# EAGLE design Group_05 (EAGLE 9.6.2)
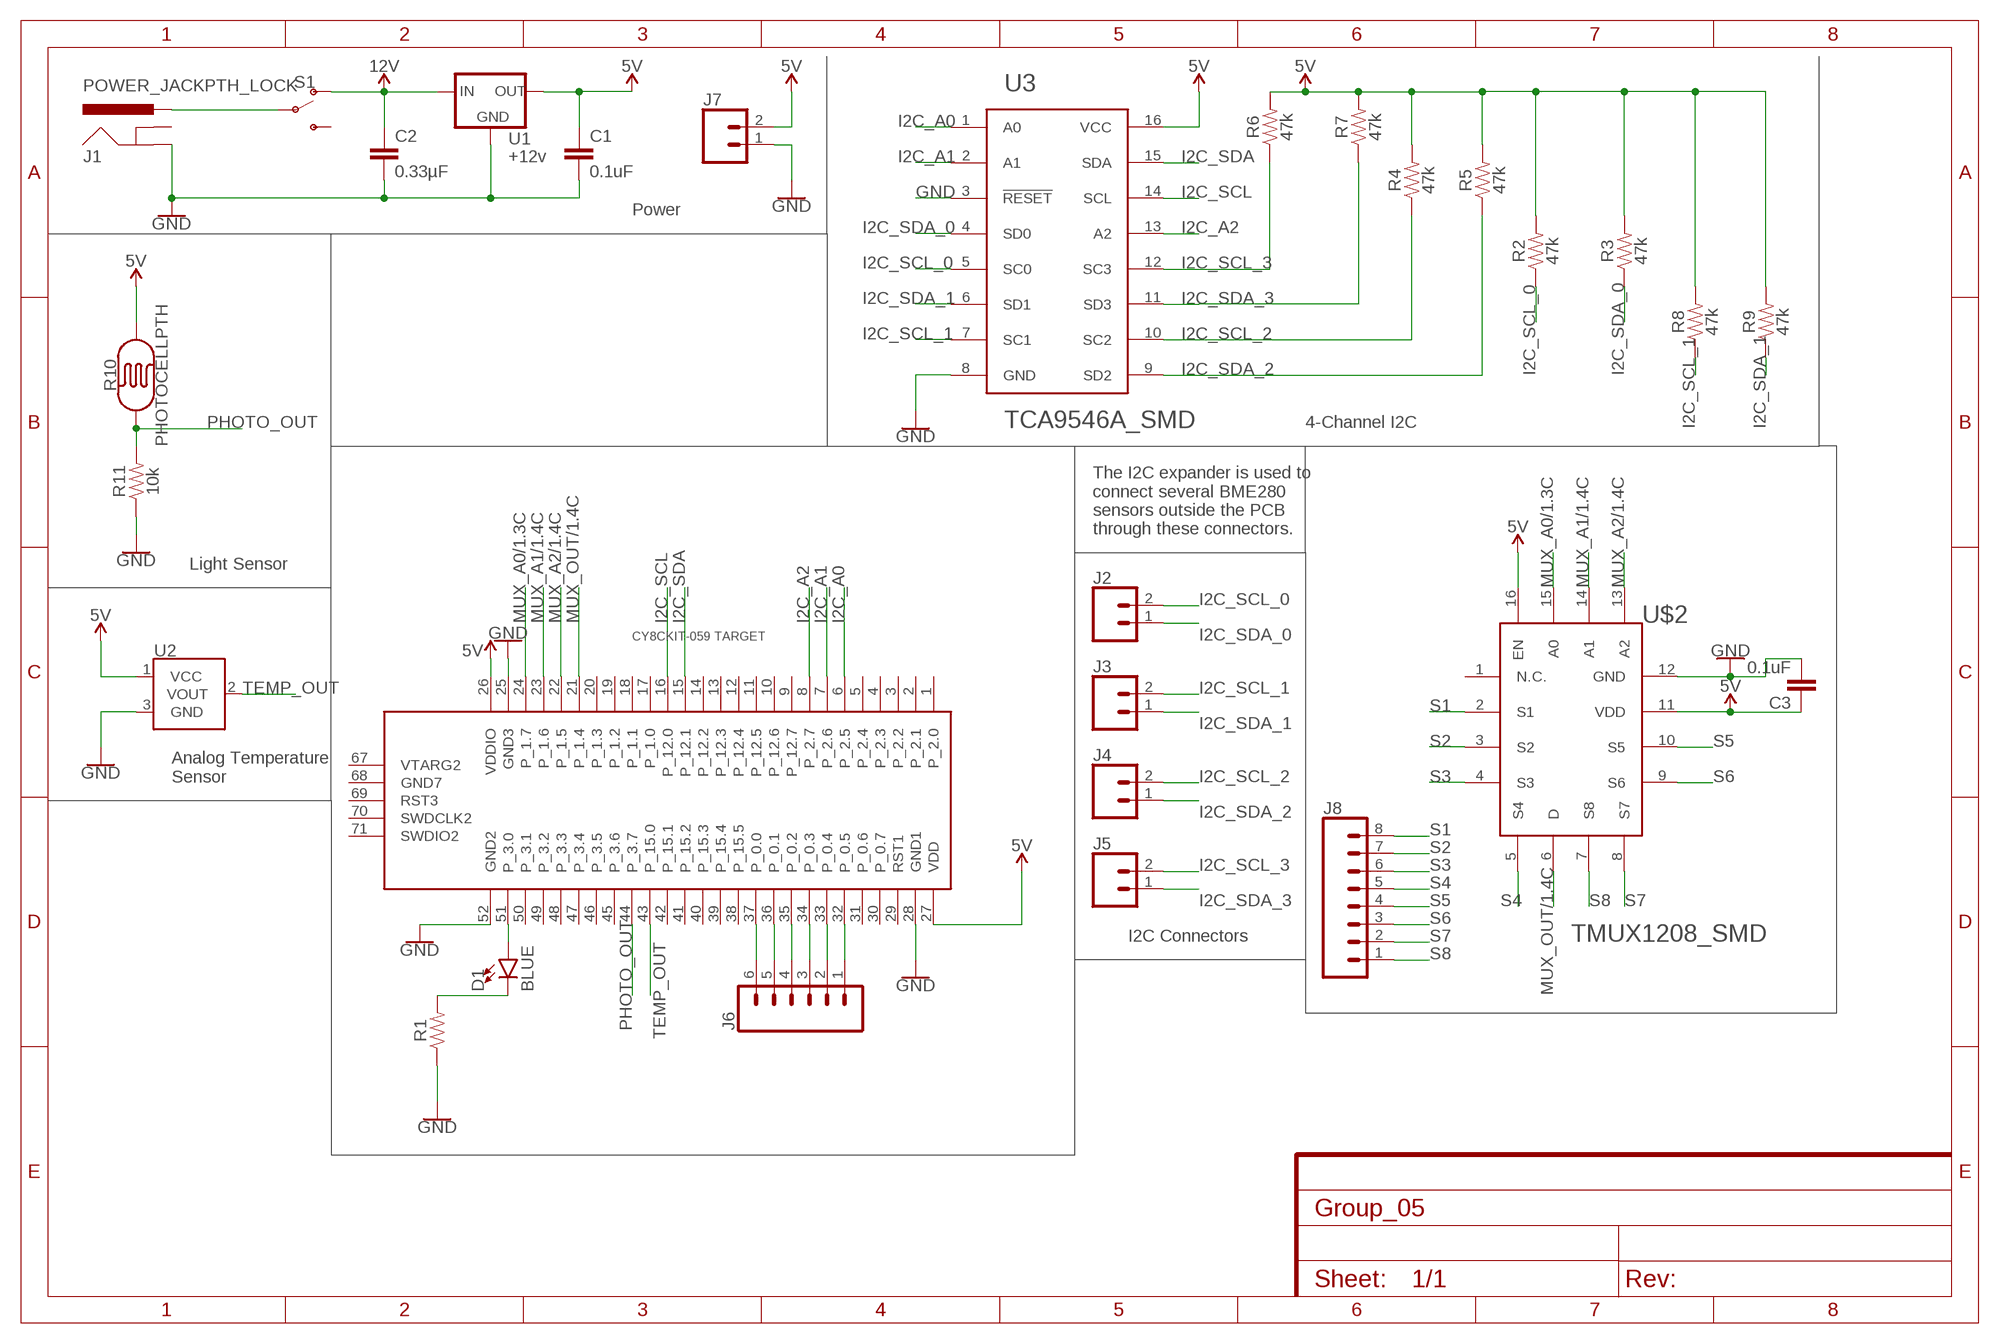
[diagram p0: schematic, sheet 1]

## Parts
C1  0.1uF  0.1UF-KIT-EZ-50V-20%  [CAP-PTH-SMALL-KIT]
C2  0.33µF  0.33UF/330NF-0805-50V-10%  [0805]
C3  0.1uF  0.1UF-KIT-EZ-50V-20%  [CAP-PTH-SMALL-KIT]
D1  BLUE  LED-BLUE1206  [LED-1206]
J1  POWER_JACKPTH_LOCK  [POWER_JACK_PTH_LOCK]
J2  CONN_02  [1X02]
J3  CONN_02  [1X02]
J4  CONN_02  [1X02]
J5  CONN_02  [1X02]
J6  CONN_06LOCK  [1X06_LOCK]
J7  CONN_02  [1X02]
J8  CONN_08LOCK  [1X08_LOCK]
R1  RESISTORAXIAL-0.3  [AXIAL-0.3]
R2  47k  47KOHM-0603-1/10W-1%  [0603]
R3  47k  47KOHM-0603-1/10W-1%  [0603]
R4  47k  47KOHM-0603-1/10W-1%  [0603]
R5  47k  47KOHM-0603-1/10W-1%  [0603]
R6  47k  47KOHM-0603-1/10W-1%  [0603]
R7  47k  47KOHM-0603-1/10W-1%  [0603]
R8  47k  47KOHM-0603-1/10W-1%  [0603]
R9  47k  47KOHM-0603-1/10W-1%  [0603]
R10  PHOTOCELLPTH  [PHOTOCELL]
R11  10k  10KOHM-0603-1/10W-1%  [0603]
S1  SWITCH-SPDT-PTH-11.6X4.0MM  [SWITCH_SPDT_PTH_11.6X4.0MM]
U1  +12v  V_REG_78XX7812  [TO-252]
U2  TMP36GT9  [TO-92]
U3  TCA9546A_SMD  [TSSOP16]
U$1  CY8CKIT-059_TARGET  [CY8CKIT-059_TARGET]
U$2  TMUX1208_SMD  [QFN16]

## Nets
5V: C1.1 C3.1 J7.2 R2.2 R3.2 R4.2 R5.2 R6.2 R7.2 R8.2 R9.2 R10.2 U1.2(OUT) U2.1(VCC) U3.16(VCC) U$1.26(VDDIO) U$1.27(VDD) U$2.11(VDD) U$2.16(EN)
12V: C2.1 S1.1(O) U1.1(IN)
GND: C1.2 C2.2 C3.2 J1.GND J7.1 R1.P$1 R11.1 U1.3(GND) U2.3(GND) U3.3(!RESET) U3.8(GND) U$1.25(GND3) U$1.28(GND1) U$1.52(GND2) U$2.12(GND)
I2C_A0: U3.1(A0) U$1.6(P_2.5)
I2C_A1: U3.2(A1) U$1.7(P_2.6)
I2C_A2: U3.13(A2) U$1.8(P_2.7)
I2C_SCL: U3.14(SCL) U$1.16(P_12.0)
I2C_SCL_0: J2.2 R2.1 U3.5(SC0)
I2C_SCL_1: J3.2 R8.1 U3.7(SC1)
I2C_SCL_2: J4.2 R4.1 U3.10(SC2)
I2C_SCL_3: J5.2 R6.1 U3.12(SC3)
I2C_SDA: U3.15(SDA) U$1.15(P_12.1)
I2C_SDA_0: J2.1 R3.1 U3.4(SD0)
I2C_SDA_1: J3.1 R9.1 U3.6(SD1)
I2C_SDA_2: J4.1 R5.1 U3.9(SD2)
I2C_SDA_3: J5.1 R7.1 U3.11(SD3)
MUX_A0/1.3C: U$1.24(P_1.7) U$2.15(A0)
MUX_A1/1.4C: U$1.23(P_1.6) U$2.14(A1)
MUX_A2/1.4C: U$1.22(P_1.5) U$2.13(A2)
MUX_OUT/1.4C: U$1.21(P_1.4) U$2.6(D)
N$1: J6.6 U$1.37(P_0.0)
N$2: D1.A U$1.51(P_3.0)
N$3: J1.PWR S1.2(P)
N$4: D1.C R1.P$2
N$5: J6.5 U$1.36(P_0.1)
N$6: J6.4 U$1.35(P_0.2)
N$7: J6.3 U$1.34(P_0.3)
N$8: J6.2 U$1.33(P_0.4)
N$9: J6.1 U$1.32(P_0.5)
PHOTO_OUT: R10.1 R11.2 U$1.44(P_3.7)
S1: J8.8 U$2.2(S1)
S2: J8.7 U$2.3(S2)
S3: J8.6 U$2.4(S3)
S4: J8.5 U$2.5(S4)
S5: J8.4 U$2.10(S5)
S6: J8.3 U$2.9(S6)
S7: J8.2 U$2.8(S7)
S8: J8.1 U$2.7(S8)
TEMP_OUT: U2.2(VOUT) U$1.43(P_15.0)
Unconnected: J1.GNDBREAK S1.3(S) U$1.1(P_2.0) U$1.2(P_2.1) U$1.3(P_2.2) U$1.4(P_2.3) U$1.5(P_2.4) U$1.9(P_12.7) U$1.10(P_12.6) U$1.11(P_12.5) U$1.12(P_12.4) U$1.13(P_12.3) U$1.14(P_12.2) U$1.17(P_1.0) U$1.18(P_1.1) U$1.19(P_1.2) U$1.20(P_1.3) U$1.29(RST1) U$1.30(P_0.7) U$1.31(P_0.6) U$1.38(P_15.5) U$1.39(P_15.4) U$1.40(P_15.3) U$1.41(P_15.2) U$1.42(P_15.1) U$1.45(P_3.6) U$1.46(P_3.5) U$1.47(P_3.4) U$1.48(P_3.3) U$1.49(P_3.2) U$1.50(P_3.1) U$1.67(VTARG2) U$1.68(GND7) U$1.69(RST3) U$1.70(SWDCLK2) U$1.71(SWDIO2) U$2.1(N.C.)

## Notes on the sheet
- Power
- 4-Channel I2C
- The I2C expander is used to 
  connect several BME280 
  sensors outside the PCB 
  through these connectors.
- Light Sensor
- Analog Temperature
  Sensor
- I2C Connectors

## Library data of the parts
C1 C3 = SparkFun-Capacitors:0.1UF: 0.1µF ceramic capacitors A capacitor is a passive two-terminal electrical component used to store electrical energy temporarily in an electric field.; PROD_ID: CAP-08370
C2 = SparkFun-Capacitors:0.33UF/330NF: 0.33µF/330nF ceramic capacitors A capacitor is a passive two-terminal electrical component used to store electrical energy temporarily in an electric field.; PROD_ID: CAP-08469
D1 = SparkFun-LED:LED-BLUE: Blue SMD LED Used in manufacturing of various products at SparkFun Packages: 0603 - SMD 0603 package [Product Link] <http://www.digikey.com/product-detail/en/SMLE12BC7TT86/511-1589-2-ND/1641808> 1206 - SMD1206 package [Product Link] <http://www.digikey.com/product-detail/en/lite-on-inc/LTST-C150TBKT/160-1643-1-ND/573584> SparkFun Products: ESP8266 Thing-Dev Board <https://www.sparkfun.com/products/13711> RedBoard <https://www.sparkfun.com/products/12757>; PROD_ID: DIO-09911
J1 = SparkFun-Connectors:POWER_JACK: Power Jack Connector This is the standard 5.5mm barrel jack for power. The PTH is the most common, proven, reliable, footprint. The Slot footprint only works if the mill layer is transmitted to the PCB fab house so be warned. Here are the connectors we sell at SparkFun: DC Barrel Power Jack/Connector <https://www.sparkfun.com/products/119> (PRT-00119) DC Barrel Power Jack/Connector (SMD) <https://www.sparkfun.com/products/12748> (PRT-12748) DC Barrel Jack Adapter - Breadboard Compatible <https://www.sparkfun.com/products/10811> (PRT-10811) It is used on this SparkFun product (and many, many others): SparkFun RedBoard - Programmed with Arduino <https://www.sparkfun.com/products/12757> (DEV-12757) Also, if you need a mating power supply or connector, please check these out: Wall Adapter Power Supply - 9VDC 650mA <https://www.sparkfun.com/products/298> (TOL-00298) DC Barrel Jack Adapter - Male <https://www.sparkfun.com/products/10287> (PRT-10287); PROD_ID: CONN-08197; SF_ID: PRT-00119
J2-J5 J7 = SparkFun-Connectors:CONN_02: Multi connection point. Often used as Generic Header-pin footprint for 0.1 inch spaced/style header connections On any of the 0.1 inch spaced packages, you can populate with these: Break Away Headers - Straight <https://www.sparkfun.com/products/116> (PRT-00116) Break Away Male Headers - Right Angle <https://www.sparkfun.com/products/553> (PRT-00553) Female Headers <https://www.sparkfun.com/products/115> (PRT-00115) Break Away Headers - Machine Pin <https://www.sparkfun.com/products/117> (PRT-00117) Break Away Female Headers - Swiss Machine Pin <https://www.sparkfun.com/products/743> (PRT-00743) For SCREWTERMINALS and SPRING TERMINALS visit here: Screw Terimnals on SparkFun.com <https://www.sparkfun.com/search/results?term=Screw+Terminals> (5mm/3.5mm/2.54mm spacing) This device is also useful as a general connection point to wire up your design to another part of your project. Our various solder wires solder well into these plated through hole pads. Hook-Up Wire - Assortment (Stranded, 22 AWG) <https://www.sparkfun.com/products/11375> (PRT-11375) Hook-Up Wire - Assortment (Solid Core, 22 AWG) <https://www.sparkfun.com/products/11367> (PRT-11367) View the entire wire category on our website here <https://www.sparkfun.com/categories/141> Special notes: Molex polarized connector foot print use with: PRT-08233 with associated crimp pins and housings. 2.54_SCREWTERM for use with PRT-10571. 3.5mm Screw Terminal footprints for PRT-08084 5mm Screw Terminal footprints for use with PRT-08432
J6 = SparkFun-Connectors:CONN_06: Multi connection point. Often used as Generic Header-pin footprint for 0.1 inch spaced/style header connections On any of the 0.1 inch spaced packages, you can populate with these: Break Away Headers - Straight <https://www.sparkfun.com/products/116> (PRT-00116) Break Away Male Headers - Right Angle <https://www.sparkfun.com/products/553> (PRT-00553) Female Headers <https://www.sparkfun.com/products/115> (PRT-00115) Break Away Headers - Machine Pin <https://www.sparkfun.com/products/117> (PRT-00117) Break Away Female Headers - Swiss Machine Pin <https://www.sparkfun.com/products/743> (PRT-00743) Arduino Stackable Header - 6 Pin <https://www.sparkfun.com/products/9280> (PRT-09280) For SCREWTERMINALS and SPRING TERMINALS visit here: Screw Terimnals on SparkFun.com <https://www.sparkfun.com/search/results?term=Screw+Terminals> (5mm/3.5mm/2.54mm spacing) This device is also useful as a general connection point to wire up your design to another part of your project. Our various solder wires solder well into these plated through hole pads. Hook-Up Wire - Assortment (Stranded, 22 AWG) <https://www.sparkfun.com/products/11375> (PRT-11375) Hook-Up Wire - Assortment (Solid Core, 22 AWG) <https://www.sparkfun.com/products/11367> (PRT-11367) View the entire wire category on our website here <https://www.sparkfun.com/categories/141>
J8 = SparkFun-Connectors:CONN_08: Multi connection point. Often used as Generic Header-pin footprint for 0.1 inch spaced/style header connections On any of the 0.1 inch spaced packages, you can populate with these: Break Away Headers - Straight <https://www.sparkfun.com/products/116> (PRT-00116) Break Away Male Headers - Right Angle <https://www.sparkfun.com/products/553> (PRT-00553) Female Headers <https://www.sparkfun.com/products/115> (PRT-00115) Break Away Headers - Machine Pin <https://www.sparkfun.com/products/117> (PRT-00117) Break Away Female Headers - Swiss Machine Pin <https://www.sparkfun.com/products/743> (PRT-00743) Arduino Stackable Header - 8 Pin <https://www.sparkfun.com/products/9279> (PRT-09279) For SCREWTERMINALS and SPRING TERMINALS visit here: Screw Terimnals on SparkFun.com <https://www.sparkfun.com/search/results?term=Screw+Terminals> (5mm/3.5mm/2.54mm spacing) This device is also useful as a general connection point to wire up your design to another part of your project. Our various solder wires solder well into these plated through hole pads. Hook-Up Wire - Assortment (Stranded, 22 AWG) <https://www.sparkfun.com/products/11375> (PRT-11375) Hook-Up Wire - Assortment (Solid Core, 22 AWG) <https://www.sparkfun.com/products/11367> (PRT-11367) View the entire wire category on our website here <https://www.sparkfun.com/categories/141> Special notes: Molex polarized connector foot print use with SKU : PRT-08231 with associated crimp pins and housings. 1MM SMD Version SKU: PRT-10208 NOTES ON THE VARIANTS LOCK and LOCK_LONGPADS... This footprint was designed to help hold the alignment of a through-hole component (i.e. 6-pin header) while soldering it into place. You may notice that each hole has been shifted either up or down by 0.005 of an inch from it's more standard position (which is a perfectly straight line). This slight alteration caused the pins (the squares in the middle) to touch the edges of the holes. Because they are alternating, it causes a "brace" to hold the component in place. 0.005 has proven to be the perfect amount of "off-center" position when using our standard breakaway headers. Although looks a little odd when you look at the bare footprint, once you have a header in there, the alteration is very hard to notice. Also,if you push a header all the way into place, it is covered up entirely on the bottom side.
R1 = SparkFun-Resistors:RESISTOR: Generic Resistor Package
R2-R9 = SparkFun-Resistors:47KOHM: 47kΩ resistor A resistor is a passive two-terminal electrical component that implements electrical resistance as a circuit element. Resistors act to reduce current flow, and, at the same time, act to lower voltage levels within circuits. - Wikipedia; PROD_ID: RES-07871
R10 = SparkFun-Sensors:PHOTOCELL: Photocell (Photodetector, Photo Resistor, CdS) This is a very small light sensor. A photocell changes (also called a photodetector, photo resistor, CdS or photoconductive cell) resistance depending on the amount of light it is exposed to. These little sensors make great ambient light triggers (when light in the room turns on, do something). Datasheet <http://cdn.sparkfun.com/datasheets/Sensors/LightImaging/SEN-09088.pdf> SparkFun Products Mini Photocell <https://www.sparkfun.com/products/9088> (SEN-09088); PROD_ID: COMP-09129; SF_ID: SEN-09088
R11 = SparkFun-Resistors:10KOHM: 10kΩ resistor A resistor is a passive two-terminal electrical component that implements electrical resistance as a circuit element. Resistors act to reduce current flow, and, at the same time, act to lower voltage levels within circuits. - Wikipedia; PROD_ID: RES-00824
S1 = SparkFun-Switches:SWITCH-SPDT: Single Pole, Double Throw (SPDT) Switch Single-pole, double-throw (SPDT) switch. Variant Overview SMD-AYZ0202 Surface Mount DPDT Switch <https://www.sparkfun.com/products/597> (COM-00597) Used on e.g. LilyPad Arduino USB - ATmega32U4 Board <https://www.sparkfun.com/products/12049> PTH-11.6X4.0MM SPDT Mini Power Switch <https://www.sparkfun.com/products/102> (COM-00102) Used on e.g. SparkFun Simon Says - Through-Hole Soldering Kit <https://www.sparkfun.com/products/10547> (KIT-10547) PTH-11.6X4.0MM-KIT KIT version of SPDT Mini Power Switch - Simplifies soldering by removing tStop of switch pins - only one side can be soldered. PTH-11.6X4.0MM-LOCK LOCK version of SPDT Mini Power Switch - Offset pins hold switch in place for easier soldering. SMD-RIGHT-ANGLE Surface Mount Right Angle Switch <https://www.sparkfun.com/products/10860> (COM-10860) Used on e.g. SparkFun ESP8266 Thing <https://www.sparkfun.com/products/13231>; PROD_ID: SWCH-08261; SF_SKU: COM-00102
U1 = SparkFun-IC-Power:V_REG_78XX: Voltage Regulator Standard 78xx regulator. IGO (Input Ground Output). Spark Fun Electronics SKU : COM-00107; PROD_ID: VREG-12370
U2 = SparkFun-Sensors:TMP36: TMP36 Precision Analog °C Temperature Sensor The TMP36 is a low voltage, precision centigrade temperature sensor. It provides a voltage output that is linearly proportional to the Celsius temperature. It also doesn’t require any external calibration to provide typical accuracies of ±1°C at +25°C and ±2°C over the −40°C to +125°C temperature range. We like it because it’s so easy to use: Just give the device a ground and 2.7 to 5.5 VDC and read the voltage on the Vout pin. The output voltage can be converted to temperature easily using the scale factor of 10 mV/°C. Datasheet <http://cdn.sparkfun.com/datasheets/Sensors/Temp/TMP35_36_37.pdf> SparkFun Products Temperature Sensor - TMP36 <https://www.sparkfun.com/products/10988> (SEN-10988) SparkFun Danger Shield <https://www.sparkfun.com/products/11649> (DEV-11649); PROD_ID: IC-09880; SF_ID: SEN-10988
U3 = Group_05_Library:TCA9546A: TCA9546A The TCA9546A is a quad bidirectional translating switch controlled via the I2C bus. The SCL/SDA upstream pair fans out to four downstream pairs, or channels. An active-low reset input allows the TCA9546A to recover from a situation in which one of the downstream I2C buses is stuck in a low state. The pass gates of the switches are constructed such that the VCC pin can be used to limit the maximum high voltage, which will be passed by the TCA9546A. This allows the use of different bus voltages on each pair, so that 1.8-V, 2.5-V, or 3.3-V parts can communicate with 5-V parts without any additional protection. External pull-up resistors pull the bus up to the desired voltage level for each channel. All I/O pins are 5.5-V tolerant.
U$1 = CY8KIT-059:CY8CKIT-059_TARGET: CY8CKIT-059 Target This device exposes the pins of the target section of the CY8CKIT-059, including the programming section, that must be connected to the KitProg in order to program the target micro-controller.
U$2 = Group_05_Library:TMUX1208: TMUX1208 The TMUX1208 is a general purpose complementary metal-oxide semiconductor (CMOS) multiplexers (MUX). It offers 8:1 single-ended channels. Wide operating supply of 1.08 V to 5.5 V. The device supports bidirectional analog and digital signals on the source (Sx) and drain (D) pins ranging from GND to VDD. All logic inputs have 1.8 V logic compatible thresholds, ensuring both TTL and CMOS logic compatibility when operating in the valid supply voltage range.

## Board
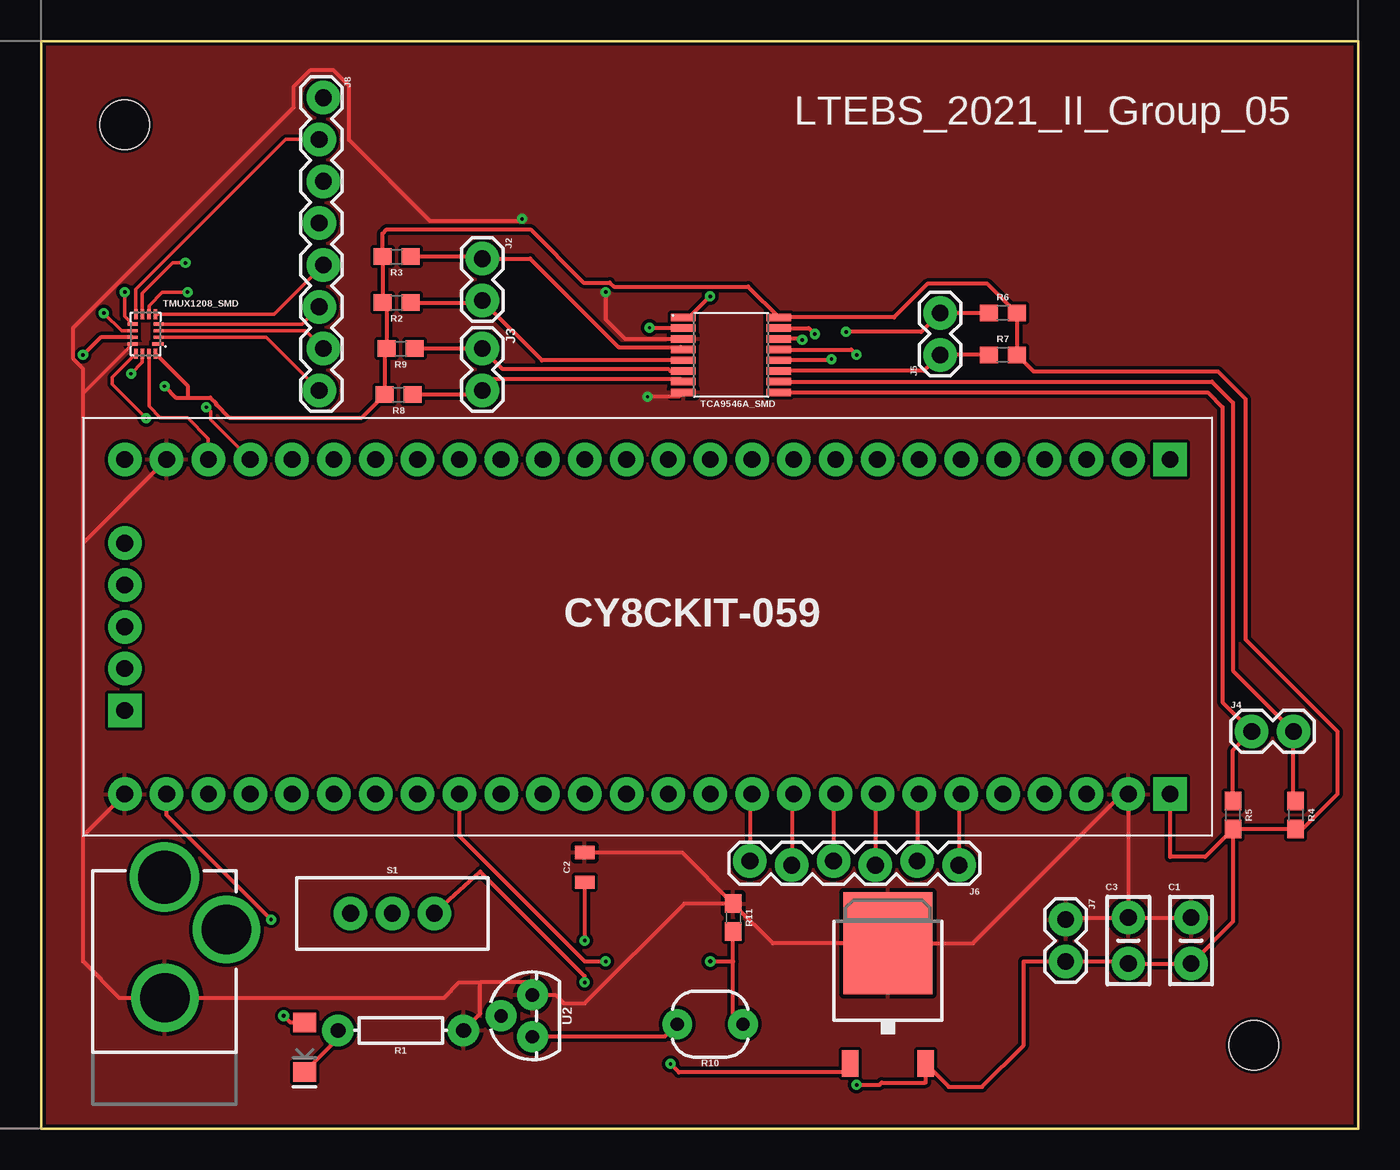
[diagram p1: board, top side]
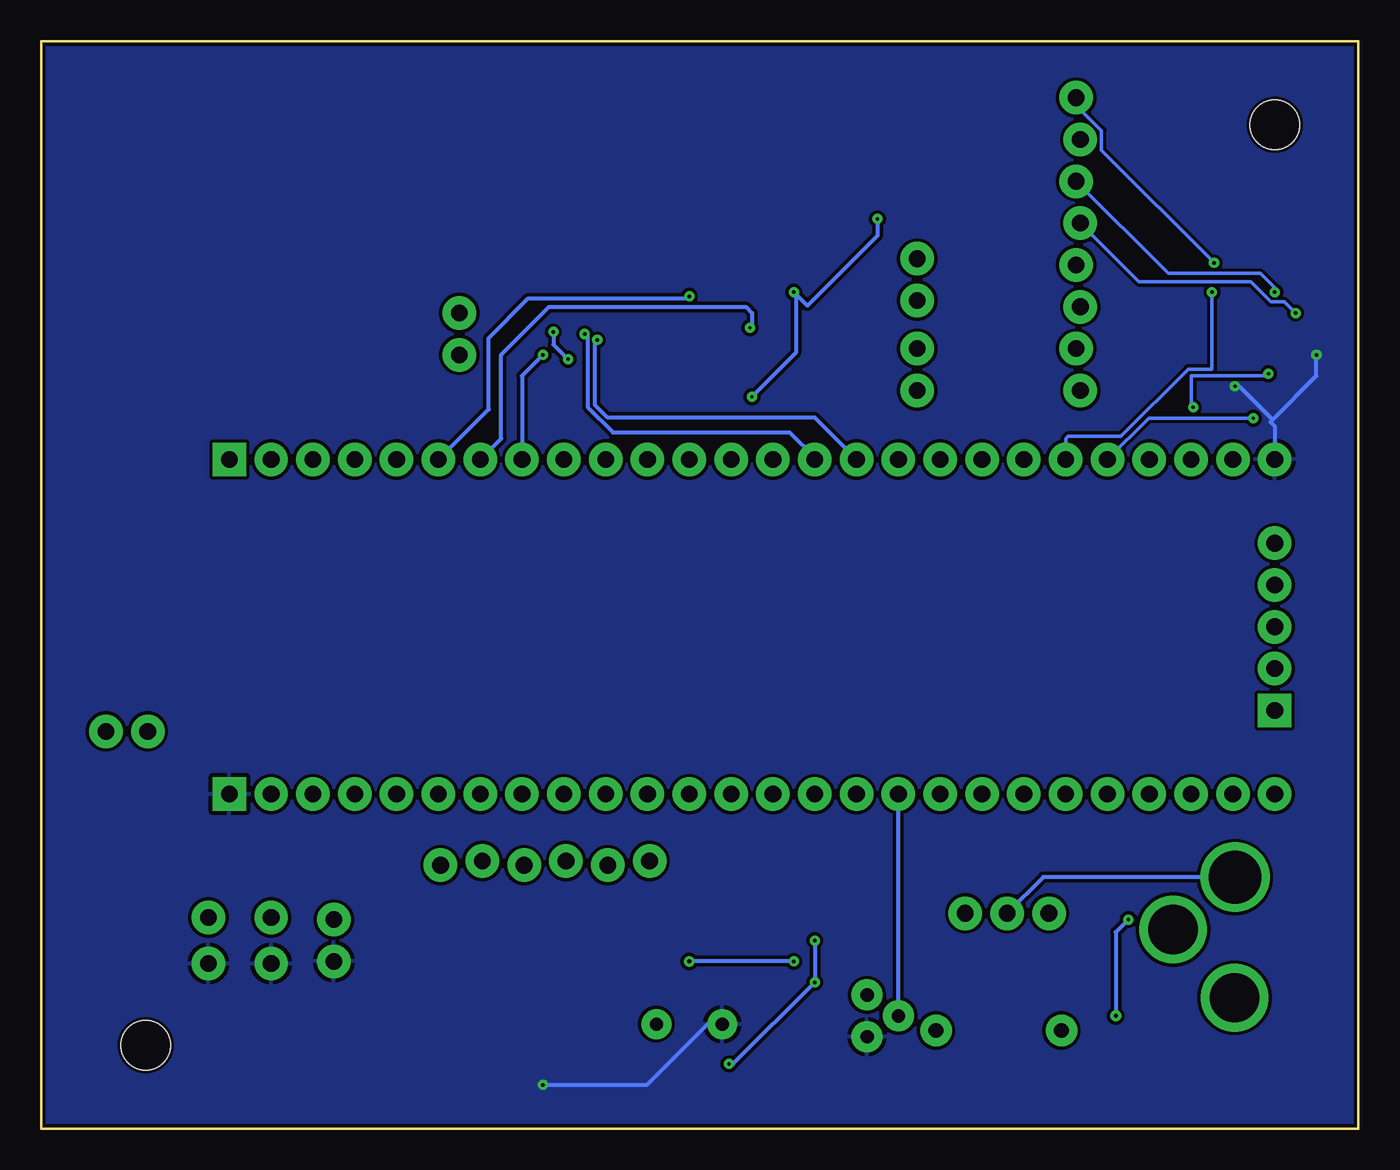
[diagram p2: board, bottom side, seen from below]

Size 80.01 x 66.04 mm. Coordinates in mm from the lower left corner, seen from the top.
Outline: 0,0 80.01,0 80.01,66.04 0,66.04 0,0
Copper layers (1*16): Top 0.035mm / dielectric 1.5mm / Bottom 0.035mm
Design rules "Group_05": minimum track width 6mil, minimum drill 8mil, track to track 6mil, track to pad 6mil, pad to pad 6mil, via to via 6mil, smd to smd 6mil, copper to edge 8mil, drill to drill 16mil, minimum pad ring 8mil, minimum via ring 8mil, stop-mask expansion 8mil, vias tented up to drill 0mil, thermal gap 10mil
Holes 3 mm at 5.08,60.96 73.66,5.08

### Footprints (pad centres in the part's own frame; a part is rotated, then mirrored left to right if it is on the bottom)
CAP-PTH-SMALL-KIT = drill 1.016 pad 2.032: 1 -1.397,0; 2 1.397,0
0805 = smd 0.8 x 1.2: 1 -0.9,0; 2 0.9,0
LED-1206 = smd 1.2 x 1.4: A -1.5,0; C 1.5,0
POWER_JACK_PTH_LOCK = drill 2.997 pad 4.115: GND 0.025,6.557; GNDBREAK 3.762,10.7 | drill 3.2 pad 4.115: PWR 0,13.878
1X02 = drill 1.016 pad 1.88: 1 0,0; 2 2.54,0
1X06_LOCK = drill 1.016 pad 1.88: 1 0,0; 2 2.54,-0.254; 3 5.08,0; 4 7.62,-0.254; 5 10.16,0; 6 12.7,-0.254
1X08_LOCK = drill 1.016 pad 1.88: 1 0,0.127; 2 2.54,-0.127; 3 5.08,0.127; 4 7.62,-0.127; 5 10.16,0.127; 6 12.7,-0.127; 7 15.24,0.127; 8 17.78,-0.127
AXIAL-0.3 = drill 0.9 pad 1.88: P$1 -3.81,0; P$2 3.81,0
0603 = smd 1.1 x 1: 1 -0.85,0; 2 0.85,0
PHOTOCELL = drill 0.8 pad 1.676: 1 -2,0; 2 2,0
SWITCH_SPDT_PTH_11.6X4.0MM = drill 1.016 pad 1.88: 1 0,2.54; 2 0,0; 3 0,-2.54
TO-252 = smd 1 x 1.6: 1 -2.28,-4.8; 2 2.28,-4.8 | smd 5.4 x 6.2: 3 0,2.5
TO-92 = drill 0.813 pad 1.88: 1 -1.27,0; 2 0,1.905; 3 1.27,0
TSSOP16 = smd 1.5 x 0.45: 1 -2.9,2.275; 2 -2.9,1.625; 3 -2.9,0.975; 4 -2.9,0.325; 5 -2.9,-0.325; 6 -2.9,-0.975; 7 -2.9,-1.625; 8 -2.9,-2.275; 9 2.9,-2.275; 10 2.9,-1.625; 11 2.9,-0.975; 12 2.9,-0.325; 13 2.9,0.325; 14 2.9,0.975; 15 2.9,1.625; 16 2.9,2.275
CY8CKIT-059_TARGET = drill 1.016 pad 1.876 square: 1 30.48,8.89; 27 30.48,-11.43; 71 -33.02,-6.35 | drill 1.016 pad 1.876: 2 27.94,8.89; 3 25.4,8.89; 4 22.86,8.89; 5 20.32,8.89; 6 17.78,8.89; 7 15.24,8.89; 8 12.7,8.89; 9 10.16,8.89; 10 7.62,8.89; 11 5.08,8.89; 12 2.54,8.89; 13 0,8.89; 14 -2.54,8.89; 15 -5.08,8.89; 16 -7.62,8.89; 17 -10.16,8.89; 18 -12.7,8.89; 19 -15.24,8.89; 20 -17.78,8.89; 21 -20.32,8.89; 22 -22.86,8.89; 23 -25.4,8.89; 24 -27.94,8.89; 25 -30.48,8.89; 26 -33.02,8.89; 28 27.94,-11.43; 29 25.4,-11.43; 30 22.86,-11.43; 31 20.32,-11.43; 32 17.78,-11.43; 33 15.24,-11.43; 34 12.7,-11.43; 35 10.16,-11.43; 36 7.62,-11.43; 37 5.08,-11.43; 38 2.54,-11.43; 39 0,-11.43; 40 -2.54,-11.43; 41 -5.08,-11.43; 42 -7.62,-11.43; 43 -10.16,-11.43; 44 -12.7,-11.43; 45 -15.24,-11.43; 46 -17.78,-11.43; 47 -20.32,-11.43; 48 -22.86,-11.43; 49 -25.4,-11.43; 50 -27.94,-11.43; 51 -30.48,-11.43; 52 -33.02,-11.43; 67 -33.02,3.81; 68 -33.02,1.27; 69 -33.02,-1.27; 70 -33.02,-3.81
QFN16 = smd 0.7 x 0.2: 1 -0.75,0.6 | smd 0.6 x 0.2: 2 -0.8,0.2; 3 -0.8,-0.2; 4 -0.8,-0.6; 9 0.8,-0.6; 10 0.8,-0.2; 11 0.8,0.2; 12 0.8,0.6 | smd 0.2 x 0.6: 5 -0.6,-1.2; 6 -0.2,-1.2; 7 0.2,-1.2; 8 0.6,-1.2; 13 0.6,1.2; 14 0.2,1.2; 15 -0.2,1.2; 16 -0.6,1.2

### Placement (x,y rotation side)
C1  69.85,11.43 90 top
C2  33.02,15.88 90 top
C3  66.04,11.43 90 top
D1  16,4.95 270 top
J1  7.49,1.4 0 top
J2  26.8,52.83 270 top
J3  26.8,47.37 270 top
J4  73.53,24.13 0 top
J5  54.61,46.99 90 top
J6  55.75,16 180 top
J7  62.23,12.7 270 top
J8  17.02,62.61 270 top
R1  21.84,5.97 180 top
R2  21.59,50.16 180 top
R3  21.59,52.96 180 top
R4  76.2,19.05 270 top
R5  72.39,19.05 270 top
R6  58.42,49.53 0 top
R7  58.42,46.99 0 top
R8  21.72,44.58 180 top
R9  21.84,47.37 180 top
R10  40.64,6.35 180 top
R11  42.04,12.83 270 top
S1  21.34,13.08 270 top
U1  51.44,8.76 0 top
U2  29.84,6.86 90 top
U3  41.91,46.99 0 top
U$1  38.1,31.75 0 top
U$2  6.35,48.26 180 top

### Tracks (layer width: path | path; a pad name or v marks a point on that pad's centre or on a via)
5V  (via drill 0.2)
  Top 0.254: R10.2 37.88,5.59 U2.1 | U$1.27 68.58,16.51 70.7,16.51 R5.2 | R5.2 R4.2 76.62,18.2 78.74,20.32 78.74,24.13 73.15,29.72 73.15,44.32 71.5,45.97 60.29,45.97 R7.2 59.32,47.04 59.27,47.09 R6.2 57.49,51.31 53.85,51.31 51.8,49.26 U3.16 42.95,51.13 34.79,51.13 34.53,51.38 32.94,51.38 29.72,54.61 21,54.61 20.74,54.35 R3.2 R2.2 20.99,49.91 R9.2 20.87,47.24 R8.2 19.47,43.18 11.43,43.18 10.62,43.99 10.62,44.06 10.28,44.4 8.89,44.4 | U$2.11 3.61,48.06 v2.54,46.99 | R5.2 72.39,12.57 C1.1 C3.1 65.91,10.16 J7.2 59.69,10.16 59.69,5.08 57.15,2.54 55.14,2.54 U1.2 53.72,2.79 51.05,2.79 50.92,2.67 v49.53,2.67 | v7.49,45.08 8.18,44.4 8.89,44.4 | U$2.16 8.89,45.12 8.89,44.4
  Bottom 0.254: v49.53,2.67 43.21,2.67 39.53,6.35 R10.2 | v7.49,45.08 7.24,45.08 5.21,43.05 | U$1.26 5.08,42.67 5.33,42.93 5.21,43.05 | 5.21,43.05 2.54,45.72 v2.54,46.99
  pour Bottom (isolate 0.203): 0,0 0,66.04 80.01,66.04 80.01,0
12V  (via drill 0.2)
  Top 0.254: S1.1 26.67,15.62 33.02,9.27 v33.02,8.89 | v38.23,3.94 38.74,3.43 49.15,3.43 49.16,3.44 U1.1 | C2.1 v33.02,11.43
  Bottom 0.254: v38.23,3.94 37.97,3.94 v33.02,8.89 v33.02,11.43
GND  (via drill 0.2)
  Top 0.203: U$2.12 2.54,44.65
  Top 0.254: R11.1 44.45,11.26 U1.3 56.6,11.26 65.66,20.32 U$1.28 C3.2 | R11.1 39.08,13.68 33.02,7.62 31.75,7.62 31.24,8.13 U2.3 29.72,8.26 29.72,8.89 26.67,8.89 | C2.2 38.94,16.78 R11.1 | U$1.52 2.54,17.78 | 2.54,17.78 2.54,10.16 4.75,7.95 J1.GND 24.46,7.95 25.4,8.89 26.67,8.89 | 2.54,17.78 2.54,35.56 | 2.54,35.56 U$1.25 | 2.54,35.56 2.54,44.65 2.54,46.16 1.96,46.75 1.96,48.63 15.34,62.01 15.34,63.27 16.33,64.26 17.78,64.26 18.69,63.35 18.69,60.05 23.62,55.12 29.08,55.12 v29.21,55.24 | v34.29,50.8 34.29,49.15 35.47,47.96 U3.3 | U3.8 38.75,44.45 v36.83,44.45 | J7.1 62.36,12.83 C3.2 | C3.2 C1.2 | R1.P$1 26.67,6.99 26.67,8.89
  Bottom 0.254: v29.21,55.24 29.21,54.23 33.46,49.97 v34.29,50.8 34.16,50.67 34.16,47.12 v36.83,44.45
  pour Top (isolate 0.203): 0,0 0,66.04 80.01,66.04 80.01,0
I2C_A0  (via drill 0.2)
  Top 0.254: v40.64,50.55 39.36,49.26 U3.1
  Bottom 0.254: U$1.6 52.83,43.69 52.83,48.01 50.42,50.42 40.77,50.42 v40.64,50.55
I2C_A1  (via drill 0.2)
  Top 0.254: v36.96,48.64 38.98,48.64 U3.2
  Bottom 0.254: U$1.7 52.07,41.91 52.07,46.99 49.15,49.91 37.21,49.91 36.83,49.53 36.83,48.77 v36.96,48.64
I2C_A2  (via drill 0.2)
  Top 0.254: U3.13 49.21,47.31 v49.53,46.99
  Bottom 0.254: v49.53,46.99 50.8,45.72 U$1.8
I2C_SCL  (via drill 0.2)
  Top 0.254: v46.23,47.9 46.16,47.96 U3.14
  Bottom 0.254: U$1.16 33.02,43.18 45.59,43.18 46.36,43.94 46.36,47.77 v46.23,47.9
I2C_SCL_0
  Top 0.254: R2.1 26.67,50.16 J2.2 30.42,46.66 U3.5
I2C_SCL_1
  Top 0.254: R8.1 26.54,44.58 J3.2 27.48,45.51 38.86,45.51 U3.7
I2C_SCL_2
  Top 0.254: R4.1 76.07,20.03 J4.2 72.39,27.81 72.39,44.09 71.12,45.36 U3.10
I2C_SCL_3  (via drill 0.2)
  Top 0.254: R6.1 J5.2 53.47,48.39 v48.9,48.39 | v48.01,46.73 47.94,46.66 U3.12
  Bottom 0.254: v48.9,48.39 48.9,47.62 v48.01,46.73
I2C_SDA  (via drill 0.2)
  Top 0.254: U3.15 46.64,48.61 v46.99,48.26
  Bottom 0.254: v46.99,48.26 46.81,48.08 46.81,43.82 45.28,42.29 34.54,42.29 33.02,40.77 U$1.15
I2C_SDA_0
  Top 0.254: R3.1 26.67,52.96 J2.1 29.7,52.83 35.08,47.46 38.86,47.46 U3.4
I2C_SDA_1
  Top 0.254: R9.1 J3.1 28.04,46.13 38.1,46.13 38.22,46.01 U3.6
I2C_SDA_2
  Top 0.254: R5.1 72.39,22.99 J4.1 71.75,25.91 71.75,43.81 70.85,44.71 U3.9
I2C_SDA_3
  Top 0.254: R7.1 J5.1 53.64,46.01 U3.11
MUX_A0/1.3C
  Top 0.203: U$2.15 6.55,43.87 7.24,43.18 8.89,43.18 10.16,41.91 U$1.24
MUX_A1/1.4C  (via drill 0.2)
  Top 0.203: U$2.14 6.15,46.54 v5.46,45.85 | U$1.23 10.29,43.05 10.29,43.56 v10.03,43.81
  Bottom 0.203: 5.59,45.72 10.16,45.72 10.16,43.94 v10.03,43.81
  Bottom 0.254: 5.59,45.72 v5.46,45.85
MUX_A2/1.4C  (via drill 0.2)
  Top 0.203: U$2.13 4.32,45.63 4.32,45.21 v6.38,43.15
  Bottom 0.203: v6.38,43.15 12.73,43.15 U$1.22
MUX_OUT/1.4C  (via drill 0.2)
  Top 0.203: U$2.6 6.55,49.98 7.37,50.8 v8.89,50.8
  Bottom 0.203: U$1.21 17.78,41.91 17.65,42.04 14.42,42.04 10.33,46.13 8.89,46.13 v8.89,50.8
N$1
  Top 0.254: U$1.37 43.05,20.19 J6.6
N$2  (via drill 0.2, 0.25)
  Top 0.254: v13.97,12.7 7.62,19.05 U$1.51 | v14.73,6.86 15.14,6.45 D1.A
  Bottom 0.254: v13.97,12.7 14.73,11.94 v14.73,6.86
N$3
  Bottom 0.254: J1.PWR 19.14,15.28 S1.2
N$4
  Top 0.254: R1.P$2 18.03,5.48 D1.C
N$5
  Top 0.254: U$1.36 45.59,20.19 J6.5
N$6
  Top 0.254: U$1.35 48.13,20.19 J6.4
N$7
  Top 0.254: U$1.34 50.67,20.19 J6.3
N$8
  Top 0.254: U$1.33 53.21,20.19 J6.2
N$9
  Top 0.254: U$1.32 55.75,20.19 J6.1
PHOTO_OUT  (via drill 0.2, 0.25)
  Top 0.254: R10.1 42.04,6.95 42.04,10.16 | 42.04,10.16 R11.2 | v34.29,10.16 33.02,10.16 25.4,17.78 U$1.44 | v40.64,10.16 42.04,10.16
  Bottom 0.254: v34.29,10.16 v40.64,10.16
S1
  Top 0.203: U$2.2 13.66,48.06 J8.8
S2
  Top 0.203: U$2.3 16.06,48.46 J8.7
S3
  Top 0.203: U$2.4 15.84,48.86 J8.6
S4
  Top 0.203: U$2.5 14.15,49.46 J8.5
S5  (via drill 0.2)
  Top 0.203: U$2.10 4.88,48.46 v3.81,49.53
  Bottom 0.203: v3.81,49.53 4.5,50.22 5.32,50.22 6.54,51.43 13.33,51.43 J8.4
S6  (via drill 0.2)
  Top 0.203: U$2.9 5.08,49.33 v5.08,50.8
  Bottom 0.203: v5.08,50.8 5.08,51.05 5.97,51.94 11.56,51.94 J8.3
S7
  Top 0.203: U$2.8 5.75,50.96 14.86,60.07 J8.2
S8  (via drill 0.2)
  Top 0.203: U$2.7 6.15,50.73 8,52.58 v8.76,52.58
  Bottom 0.203: v8.76,52.58 15.6,59.41 15.6,60.61 17.14,62.16 J8.1
TEMP_OUT
  Bottom 0.254: U2.2 U$1.43

### Text on the board
tPlace: LTEBS_2021_II_Group_05 | CY8CKIT-059
tNames: TMUX1208_SMD | TCA9546A_SMD | C3 | C1
tValues: 0.1µF | 0.1µF